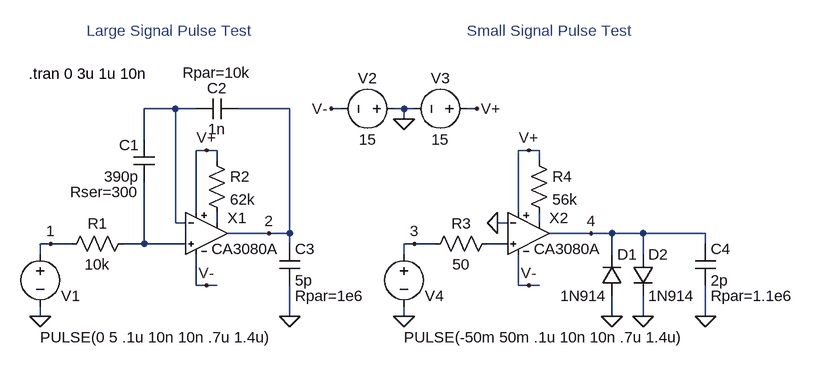
[diagram p0: schematic CA3080A_test.asc]
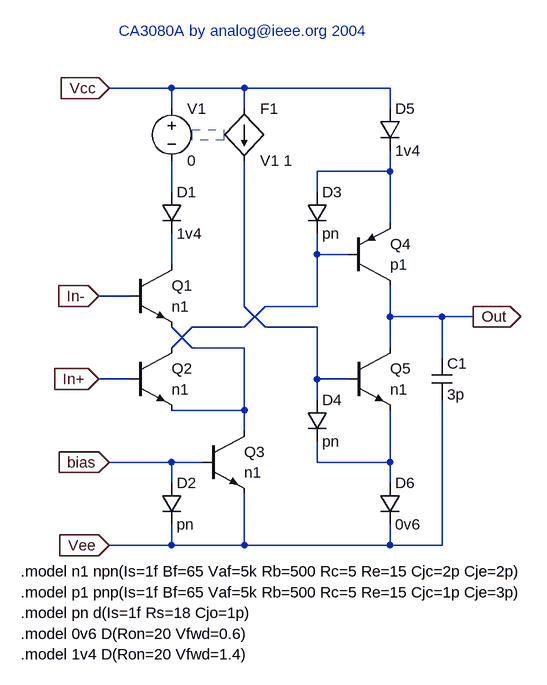
[diagram p1: sub-circuit ca3080a.asc]
CA3080A_test.asc, the LTspice schematic file:
Version 4
SHEET 1 1112 680
WIRE -240 352 -240 336
WIRE -240 256 -240 240
WIRE -240 240 -224 240
WIRE -32 32 -32 208
WIRE 32 208 32 192
WIRE 32 112 32 96
WIRE 0 256 0 304
WIRE 320 32 320 48
WIRE -112 240 -80 240
WIRE -80 240 -16 240
WIRE 48 224 112 224
WIRE 144 224 144 240
WIRE 144 304 144 352
WIRE 144 224 144 32
WIRE 144 224 112 224
WIRE 64 32 144 32
WIRE 0 32 -32 32
WIRE -80 144 -80 240
WIRE -32 208 -16 208
WIRE -80 80 -80 32
WIRE -80 32 -32 32
WIRE -224 240 -192 240
WIRE 320 352 320 336
WIRE 320 256 320 240
WIRE 320 240 336 240
WIRE 528 208 528 192
WIRE 528 112 528 96
WIRE 528 96 512 96
WIRE 496 192 496 96
WIRE 496 256 496 304
WIRE 448 240 480 240
WIRE 544 224 608 224
WIRE 784 224 784 240
WIRE 784 304 784 352
WIRE 608 224 640 224
WIRE 464 208 480 208
WIRE 336 240 368 240
WIRE 640 224 640 256
WIRE 640 320 640 352
WIRE 640 224 688 224
WIRE 688 224 688 256
WIRE 688 320 688 352
WIRE 688 224 784 224
WIRE 0 192 0 96
WIRE 0 96 16 96
WIRE 0 304 16 304
WIRE 16 96 32 96
WIRE 16 304 32 304
WIRE 208 32 224 32
WIRE 304 32 320 32
WIRE 416 32 432 32
WIRE 320 32 336 32
WIRE 512 96 496 96
WIRE 496 304 512 304
WIRE 512 304 528 304
FLAG -240 352 0
FLAG 320 48 0
FLAG 144 352 0
FLAG 112 224 2
FLAG -224 240 1
FLAG 320 352 0
FLAG 784 352 0
FLAG 608 224 4
FLAG 336 240 3
FLAG 464 208 0
FLAG 688 352 0
FLAG 640 352 0
FLAG 16 96 V+
FLAG 16 304 V-
FLAG 208 32 V-
FLAG 432 32 V+
FLAG 512 96 V+
FLAG 512 304 V-
SYMBOL voltage -240 240 R0
WINDOW 123 0 0 Left 0
WINDOW 39 0 0 Left 0
WINDOW 0 32 80 Left 0
WINDOW 3 0 144 Left 0
SYMATTR InstName V1
SYMATTR Value PULSE(0 5 .1u 10n 10n .7u 1.4u)
SYMBOL res -96 224 R90
WINDOW 0 0 56 VBottom 0
WINDOW 3 32 56 VTop 0
SYMATTR InstName R1
SYMATTR Value 10k
SYMBOL cap -64 80 M0
WINDOW 39 24 80 Left 0
WINDOW 3 24 56 Left 0
SYMATTR SpiceLine Rser=300
SYMATTR InstName C1
SYMATTR Value 390p
SYMBOL cap 64 16 R90
WINDOW 0 0 32 VBottom 0
WINDOW 3 32 32 VTop 0
WINDOW 39 -40 32 VCenter 0
SYMATTR InstName C2
SYMATTR Value 1n
SYMATTR SpiceLine Rpar=10k
SYMBOL res 16 96 R0
SYMATTR InstName R2
SYMATTR Value 62k
SYMBOL voltage 320 32 M270
WINDOW 0 32 56 VTop 0
WINDOW 3 -32 56 VBottom 0
WINDOW 123 -32 56 VBottom 0
WINDOW 39 -32 56 VBottom 0
SYMATTR InstName V2
SYMATTR Value 15
SYMBOL voltage 432 32 R90
WINDOW 123 32 56 VTop 0
WINDOW 39 32 56 VTop 0
WINDOW 0 -32 56 VBottom 0
WINDOW 3 32 56 VTop 0
SYMATTR InstName V3
SYMATTR Value 15
SYMBOL cap 128 240 R0
WINDOW 39 24 80 Left 0
WINDOW 3 24 56 Left 0
SYMATTR SpiceLine Rpar=1e6
SYMATTR InstName C3
SYMATTR Value 5p
SYMBOL voltage 320 240 R0
WINDOW 123 28 105 Left 0
WINDOW 39 0 0 Left 0
WINDOW 0 32 80 Left 0
WINDOW 3 0 144 Left 0
SYMATTR InstName V4
SYMATTR Value PULSE(-50m 50m .1u 10n 10n .7u 1.4u)
SYMBOL res 464 224 R90
WINDOW 0 0 56 VBottom 0
WINDOW 3 32 56 VTop 0
SYMATTR InstName R3
SYMATTR Value 50
SYMBOL res 512 96 R0
SYMATTR InstName R4
SYMATTR Value 56k
SYMBOL diode 656 320 R180
WINDOW 0 8 64 Right 0
WINDOW 3 24 0 Left 0
SYMATTR InstName D1
SYMATTR Value 1N914
SYMBOL diode 672 256 R0
WINDOW 3 24 64 Left 0
SYMATTR InstName D2
SYMATTR Value 1N914
SYMBOL cap 768 240 R0
WINDOW 39 24 80 Left 0
WINDOW 3 24 56 Left 0
SYMATTR SpiceLine Rpar=1.1e6
SYMATTR InstName C4
SYMATTR Value 2p
SYMBOL C:\\WINDOWS\\Desktop\\LTspice\\ca3080a 16 224 R0
SYMATTR InstName X1
SYMBOL C:\\WINDOWS\\Desktop\\LTspice\\ca3080a 512 224 R0
SYMATTR InstName X2
TEXT -258 -22 Left 0 !.tran 0 3u 1u 10n
TEXT -40 -88 Center 0 ;Large Signal Pulse Test
TEXT 544 -88 Center 0 ;Small Signal Pulse Test

ca3080a.asc, the sub-circuit schematic file:
Version 4
SHEET 1 4648 824
WIRE 1280 512 1232 512
WIRE 1136 640 1232 640
WIRE 1344 640 1344 560
WIRE 1344 464 1344 432
WIRE 1344 336 1344 432
WIRE 1232 -64 1232 -32
WIRE 1232 160 1232 208
WIRE 1232 48 1232 96
WIRE 1344 -64 1344 -32
WIRE 1344 48 1344 272
WIRE 1232 -64 1344 -64
WIRE 1344 -64 1568 -64
WIRE 1568 640 1344 640
WIRE 1568 -64 1568 -32
WIRE 1568 240 1568 288
WIRE 1568 432 1568 512
WIRE 1456 384 1456 416
WIRE 1456 480 1456 512
WIRE 1456 512 1568 512
WIRE 1568 512 1568 544
WIRE 1456 64 1456 96
WIRE 1456 160 1456 192
WIRE 1456 64 1568 64
WIRE 1568 64 1568 144
WIRE 1568 608 1568 640
WIRE 1568 32 1568 64
WIRE 1568 288 1648 288
WIRE 1568 288 1568 336
WIRE 1504 384 1456 384
WIRE 1504 192 1456 192
WIRE 1232 -64 1136 -64
WIRE 1168 256 1120 256
WIRE 1168 384 1120 384
WIRE 1264 304 1232 336
WIRE 1344 272 1376 304
WIRE 1232 304 1264 336
WIRE 1264 336 1344 336
WIRE 1456 384 1456 304
WIRE 1456 304 1376 304
WIRE 1232 640 1232 608
WIRE 1232 544 1232 512
WIRE 1232 512 1136 512
WIRE 1232 640 1344 640
WIRE 1376 272 1344 304
WIRE 1344 304 1264 304
WIRE 1456 192 1456 272
WIRE 1456 272 1376 272
WIRE 1344 432 1232 432
WIRE 1648 288 1648 352
WIRE 1648 416 1648 640
WIRE 1648 288 1696 288
WIRE 1648 640 1568 640
FLAG 1136 -64 Vcc
IOPIN 1136 -64 In
FLAG 1120 384 In+
IOPIN 1120 384 In
FLAG 1120 256 In-
IOPIN 1120 256 In
FLAG 1136 512 bias
IOPIN 1136 512 In
FLAG 1136 640 Vee
IOPIN 1136 640 In
FLAG 1696 288 Out
IOPIN 1696 288 Out
SYMBOL voltage 1232 -48 R0
WINDOW 3 24 96 Left 0
SYMATTR Value 0
SYMATTR InstName V1
SYMBOL f 1344 -32 R0
WINDOW 3 24 80 Left 0
SYMATTR Value V1 1
SYMATTR InstName F1
SYMBOL diode 1216 96 R0
SYMATTR InstName D1
SYMATTR Value 1v4
SYMBOL npn 1168 208 R0
WINDOW 0 64 32 Left 0
WINDOW 3 64 64 Left 0
SYMATTR InstName Q1
SYMATTR Value n1
SYMBOL npn 1168 336 R0
WINDOW 0 64 32 Left 0
WINDOW 3 64 64 Left 0
SYMATTR InstName Q2
SYMATTR Value n1
SYMBOL npn 1280 464 R0
WINDOW 0 64 32 Left 0
WINDOW 3 64 64 Left 0
SYMATTR InstName Q3
SYMATTR Value n1
SYMBOL diode 1216 544 R0
SYMATTR InstName D2
SYMATTR Value pn
SYMBOL diode 1440 96 R0
SYMATTR InstName D3
SYMATTR Value pn
SYMBOL diode 1440 416 R0
SYMATTR InstName D4
SYMATTR Value pn
SYMBOL pnp 1504 240 M180
WINDOW 0 64 64 Left 0
WINDOW 3 64 32 Left 0
SYMATTR InstName Q4
SYMATTR Value p1
SYMBOL npn 1504 336 R0
WINDOW 0 64 32 Left 0
WINDOW 3 64 64 Left 0
SYMATTR InstName Q5
SYMATTR Value n1
SYMBOL diode 1552 -32 R0
SYMATTR InstName D5
SYMATTR Value 1v4
SYMBOL diode 1552 544 R0
SYMATTR InstName D6
SYMATTR Value 0v6
SYMBOL cap 1632 352 R0
WINDOW 3 24 56 Left 0
SYMATTR InstName C1
SYMATTR Value 3p
TEXT 1000 776 Left 0 !.model 0v6 D(Ron=20 Vfwd=0.6)
TEXT 1000 808 Left 0 !.model 1v4 D(Ron=20 Vfwd=1.4)
TEXT 1000 744 Left 0 !.model pn d(Is=1f Rs=18 Cjo=1p)
TEXT 1000 680 Left 0 !.model n1 npn(Is=1f Bf=65 Vaf=5k Rb=500 Rc=5 Re=15 Cjc=2p Cje=2p)
TEXT 1344 -152 Center 0 ;CA3080A by analog@ieee.org 2004
TEXT 1000 712 Left 0 !.model p1 pnp(Is=1f Bf=65 Vaf=5k Rb=500 Rc=5 Re=15 Cjc=1p Cje=3p)
RECTANGLE Normal 1312 16 1264 0 2

The netlist it stands for:
* CA3080A_test.asc
V1 1 0 PULSE(0 5 .1u 10n 10n .7u 1.4u)
R1 N003 1 10k
C1 N001 N003 390p Rser=300
C2 2 N001 1n Rpar=10k
R2 V+ N002 62k
V2 0 V- 15
V3 V+ 0 15
C3 2 0 5p Rpar=1e6
V4 3 0 PULSE(-50m 50m .1u 10n 10n .7u 1.4u)
R3 N005 3 50
R4 V+ N004 56k
D1 0 4 1N914
D2 4 0 1N914
C4 4 0 2p Rpar=1.1e6
XX1 N003 N001 V+ V- 2 N002 ca3080a
XX2 N005 0 V+ V- 4 N004 ca3080a

* block symbol definitions
.subckt ca3080a In+ In- Vcc Vee Out bias
V1 Vcc N003 0
F1 Vcc N004 V1 1
D1 N003 N002 1v4
Q1 N002 In- N001 0 n1
Q2 N007 In+ N001 0 n1
Q3 N001 bias Vee 0 n1
D2 bias Vee pn
D3 N006 N007 pn
D4 N004 N005 pn
Q4 Out N007 N006 0 p1
Q5 Out N004 N005 0 n1
D5 Vcc N006 1v4
D6 N005 Vee 0v6
C1 Out Vee 3p
.model 0v6 D(Ron=20 Vfwd=0.6)
.model 1v4 D(Ron=20 Vfwd=1.4)
.model pn d(Is=1f Rs=18 Cjo=1p)
.model n1 npn(Is=1f Bf=65 Vaf=5k Rb=500 Rc=5 Re=15 Cjc=2p Cje=2p)
* CA3080A by analog@ieee.org 2004
.model p1 pnp(Is=1f Bf=65 Vaf=5k Rb=500 Rc=5 Re=15 Cjc=1p Cje=3p)
.ends ca3080a

.model D D
.lib standard.dio
.model NPN NPN
.model PNP PNP
.lib standard.bjt
.tran 0 3u 1u 10n
* Large Signal Pulse Test
* Small Signal Pulse Test
.backanno
.end